# EAGLE design VR_78XX_1 (EAGLE 7.3.0)
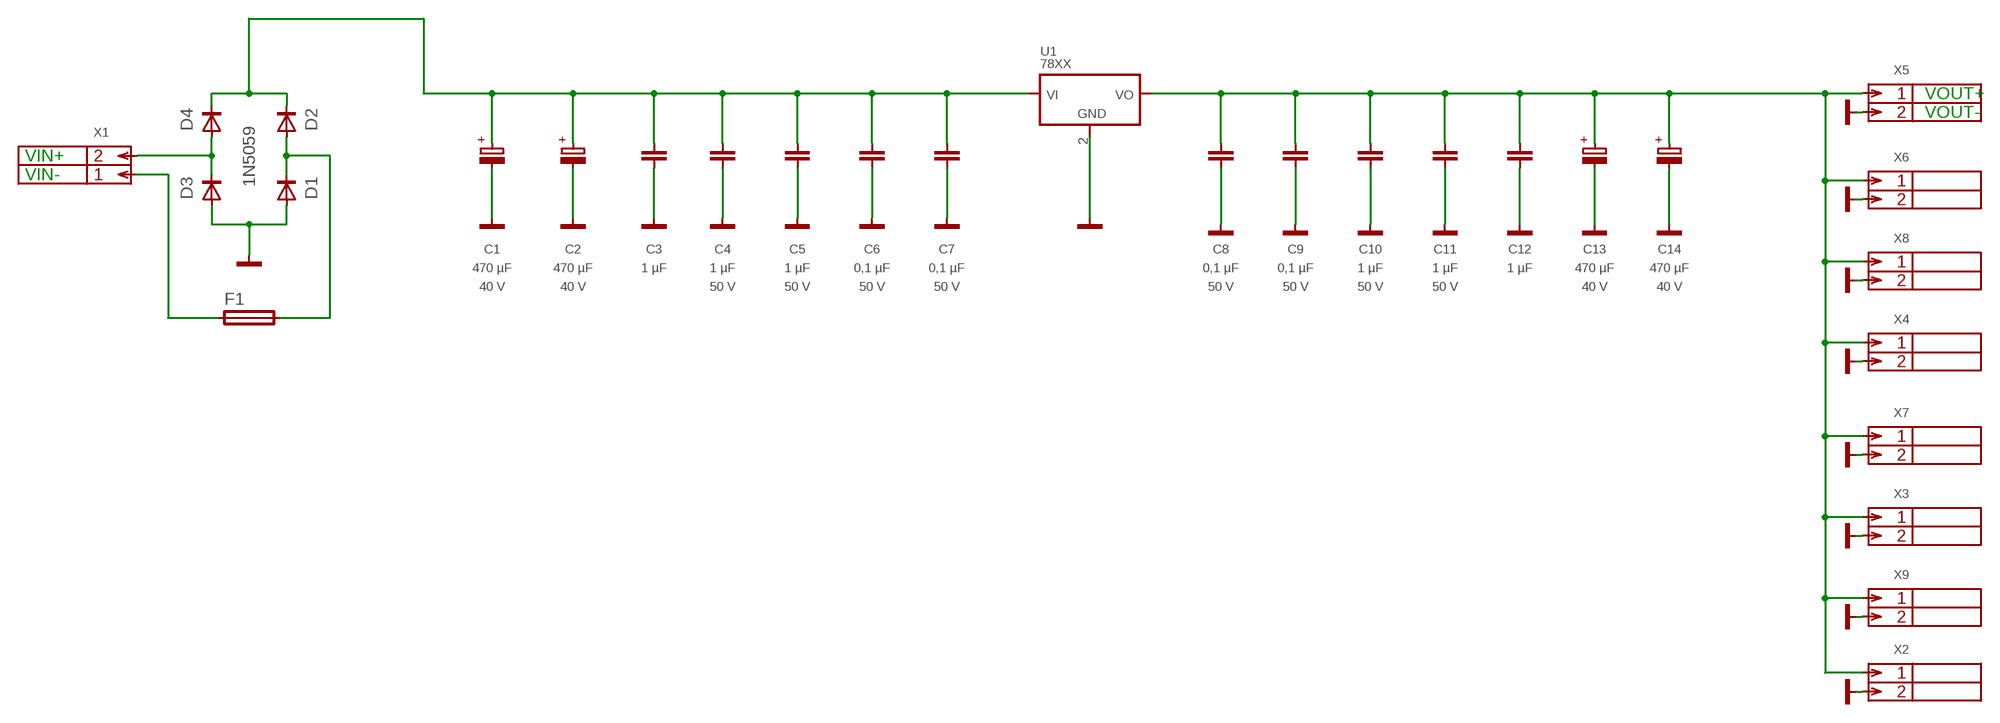
[diagram p0: schematic, sheet 1]

## Parts
C1  470 µF  BEYSHLAG-118/119AHTC  [AHT10-30C]
C2  470 µF  BEYSHLAG-118/119AHTC  [AHT10-30C]
C3  1 µF  1  [1]
C4  1 µF  C-EU050-025X075  [C050-025X075]
C5  1 µF  C-EU050-025X075  [C050-025X075]
C6  0,1 µF  C-EU050-025X075  [C050-025X075]
C7  0,1 µF  C-EU050-025X075  [C050-025X075]
C8  0,1 µF  C-EU050-025X075  [C050-025X075]
C9  0,1 µF  C-EU050-025X075  [C050-025X075]
C10  1 µF  C-EU050-025X075  [C050-025X075]
C11  1 µF  C-EU050-025X075  [C050-025X075]
C12  1 µF  1  [1]
C13  470 µF  BEYSHLAG-118/119AHTC  [AHT10-30C]
C14  470 µF  BEYSHLAG-118/119AHTC  [AHT10-30C]
D1  1N5059  [DO204-10]
D2  1N5059  [DO204-10]
D3  1N5059  [DO204-10]
D4  1N5059  [DO204-10]
F1  GSH15  [GSH15]
U1  78XX  7805T  [TO220H]
X1  AK100V5  [AK100-2V]
X2  MTA02-100  [10X02MTA]
X3  MTA02-100  [10X02MTA]
X4  MTA02-100  [10X02MTA]
X5  MTA02-100  [10X02MTA]
X6  MTA02-100  [10X02MTA]
X7  MTA02-100  [10X02MTA]
X8  MTA02-100  [10X02MTA]
X9  MTA02-100  [10X02MTA]

## Nets
GND: C1.- C2.- C3.2 C4.2 C5.2 C6.2 C7.2 C8.2 C9.2 C10.2 C11.2 C12.2 C13.- C14.- D1.A D3.A U1.2(GND) X2.2 X3.2 X4.2 X5.2 X6.2 X7.2 X8.2 X9.2
N$1: D3.C D4.A X1.P$2
N$2: D1.C D2.A F1.2
N$3: F1.1 X1.P$1
VIN+: C1.+ C2.+ C3.1 C4.1 C5.1 C6.1 C7.1 D2.C D4.C U1.1(VI)
VOUT+: C8.1 C9.1 C10.1 C11.1 C12.1 C13.+ C14.+ U1.3(VO) X2.1 X3.1 X4.1 X5.1 X6.1 X7.1 X8.1 X9.1

## Notes on the sheet
- VOUT+
- VOUT-
- VIN+
- VIN-

## Library data of the parts
C1 C2 C13 C14 = cap_vishay-pol_a:BEYSHLAG-118/119AHT: Vishay Beyshlag 118/119 AHT series polar capacitor.; VOLTAGE: 40 V
C3 C12 = CDE_DMM:1
C4-C11 = rcl_a:C-EU: CAPACITOR, European symbol; DIELECTRIC: BX; TOLERANCE: 10 %; VOLTAGE: 50 V
D1-D4 = diode_a:1N5059: DIODE controlled avalanche rectifier
F1 = fuse_a:GSH15: FUSE HOLDER grid 15mm, 19649 Wickmann
U1 = linear_a:78*: Positive VOLTAGE REGULATOR Source: http://cache.national.com/ds/LM/LM78L05.pdf http://www.fairchildsemi.com/ds/LM/LM7805.pdf
X1 = CON-AK100_a:AK100V
X2-X9 = con-amp_a:MTA02-100: AMP connector

## Board
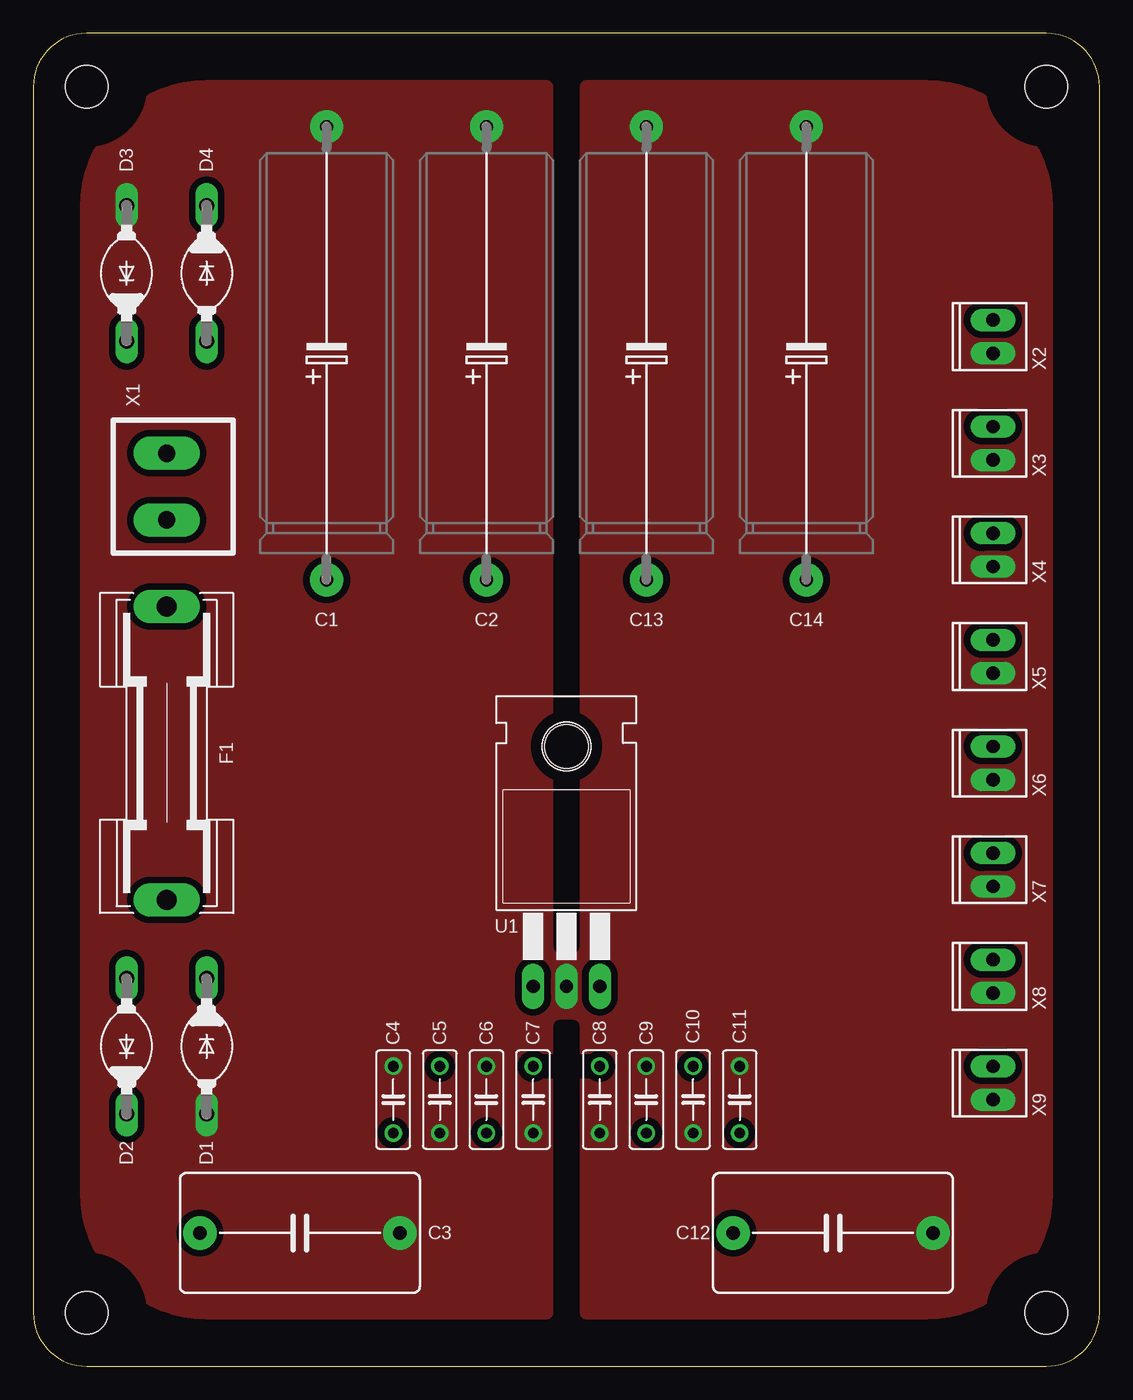
[diagram p1: board, top side]
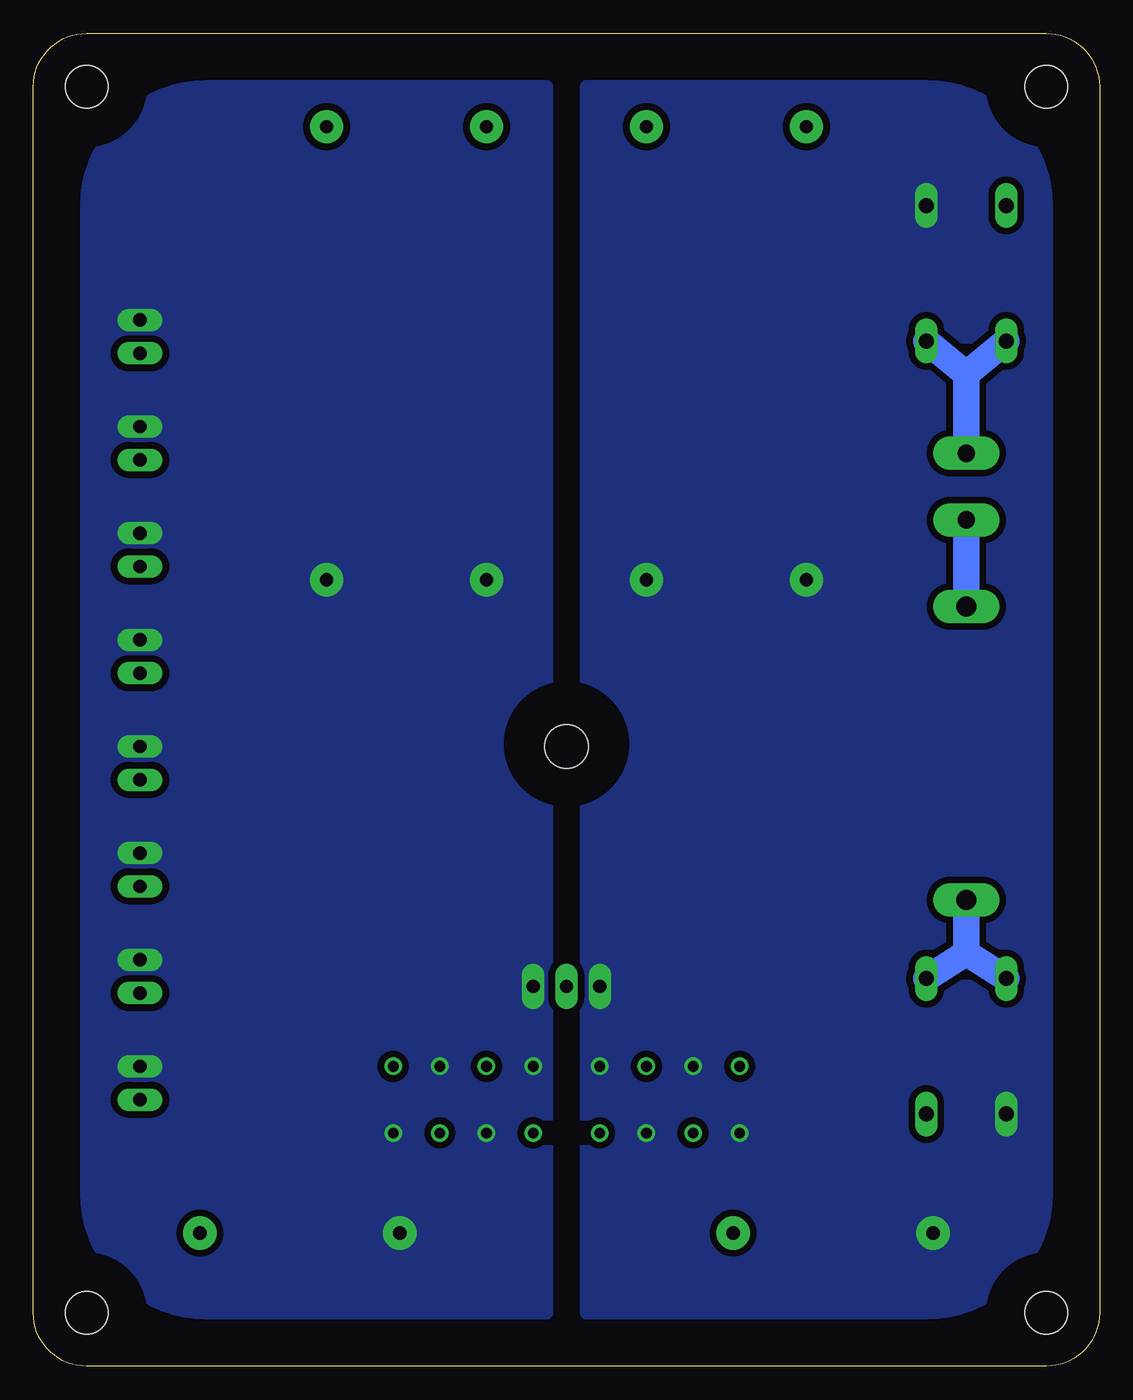
[diagram p2: board, bottom side, seen from below]

Size 80 x 100 mm. Coordinates in mm from the lower left corner, seen from the top.
Copper layers (1*16): Top 0.035mm / dielectric 1.5mm / Bottom 0.035mm
Design rules "default": minimum track width 10mil, minimum drill 24mil, track to track 8mil, track to pad 8mil, pad to pad 8mil, via to via 8mil, smd to smd 8mil, copper to edge 40mil, drill to drill 8mil, minimum pad ring 10mil, minimum via ring 8mil, stop-mask expansion 4mil, vias tented up to drill 0mil, thermal gap 10mil
tRestrict: area 0,92 to 8,100; area 72,92 to 80,100; area 0,0 to 8,8; area 72,0 to 80,8
bRestrict: area 0,92 to 8,100; area 72,92 to 80,100; area 0,0 to 8,8; area 72,0 to 80,8

### Footprints (pad centres in the part's own frame; a part is rotated, then mirrored left to right if it is on the bottom)
AHT10-30C = drill 1 pad 2.5: + -17,0; - 17,0
1 = drill 1.016 pad 2.5: 1 -7.5,0; 2 7.5,0
C050-025X075 = drill 0.8: 1 -2.5,0; 2 2.5,0
DO204-10 = drill 1.118 long: A 5.08,0; C -5.08,0
GSH15 = drill 1.5 pad 2.5 long: 1 -11,0; 2 11,0
TO220H = drill 1 pad 1.7 long: 1 -2.5,-11; 2 0,-11; 3 2.5,-11 | hole 3.3: 0,7
KRASTAI3MM = hole 3.2: 4,-4
AK100-2V = drill 1.3 pad 2.5 long: P$1 -2.5,0; P$2 2.5,0
10X02MTA = drill 1 pad 1.7 long: 1 2.5,0; 2 0,0

### Placement (x,y rotation side)
C1  22,76 90 top
C2  34,76 90 top
C3  20,10 0 top
C4  27,20 90 top
C5  30.5,20 270 top
C6  34,20 90 top
C7  37.5,20 270 top
C8  42.5,20 270 top
C9  46,20 90 top
C10  49.5,20 270 top
C11  53,20 90 top
C12  60,10 0 top
C13  46,76 90 top
C14  58,76 90 top
D1  13,24 270 top
D2  7,24 90 top
D3  7,82 90 top
D4  13,82 270 top
F1  10,46 270 top
U1  40,39.5 0 top
U$1  [KRASTAI3MM]  0,100 0 top
U$2  [KRASTAI3MM]  80,100 270 top
U$3  [KRASTAI3MM]  0,0 90 top
U$4  [KRASTAI3MM]  80,0 180 top
U$6  [100X80PCB]  0,100 0 top
X1  10,66 90 top
X2  72,76 90 top
X3  72,68 90 top
X4  72,60 90 top
X5  72,52 90 top
X6  72,44 90 top
X7  72,36 90 top
X8  72,28 90 top
X9  72,20 90 top

### Tracks (layer width: path | path; a pad name or v marks a point on that pad's centre or on a via)
GND
  pour Top (isolate 0.5, no thermals): 13,4 38.5,4 38.5,25.5 arc-90 39.5,26.5 40.5,26.5 arc-90 41.5,25.5 41.5,4 67,4 arc90 76,13 76,87 arc90 67,96 41.5,96 41.5,31.5 arc-90 40.5,30.5 39.5,30.5 arc-90 38.5,31.5 38.5,96 13,96 arc90 4,87 4,13 arc90
N$1
  Bottom 2: X1.P$2 10,74.42 | 10,74.42 D4.A | 10,74.42 D3.C
N$2
  Bottom 2: 10,31 D1.C | D2.A 10,31 | 10,31 F1.2
N$3
  Bottom 2: F1.1 X1.P$1
VIN+
  pour Bottom (isolate 0.5, no thermals): 13,4 38.5,4 38.5,96 13,96 arc90 4,87 4,13 arc90
VOUT+
  pour Bottom (isolate 0.5, no thermals): 41.5,96 41.5,4 67,4 arc90 76,13 76,87 arc90 67,96

### Text on the board
tDocu: OUTPUT